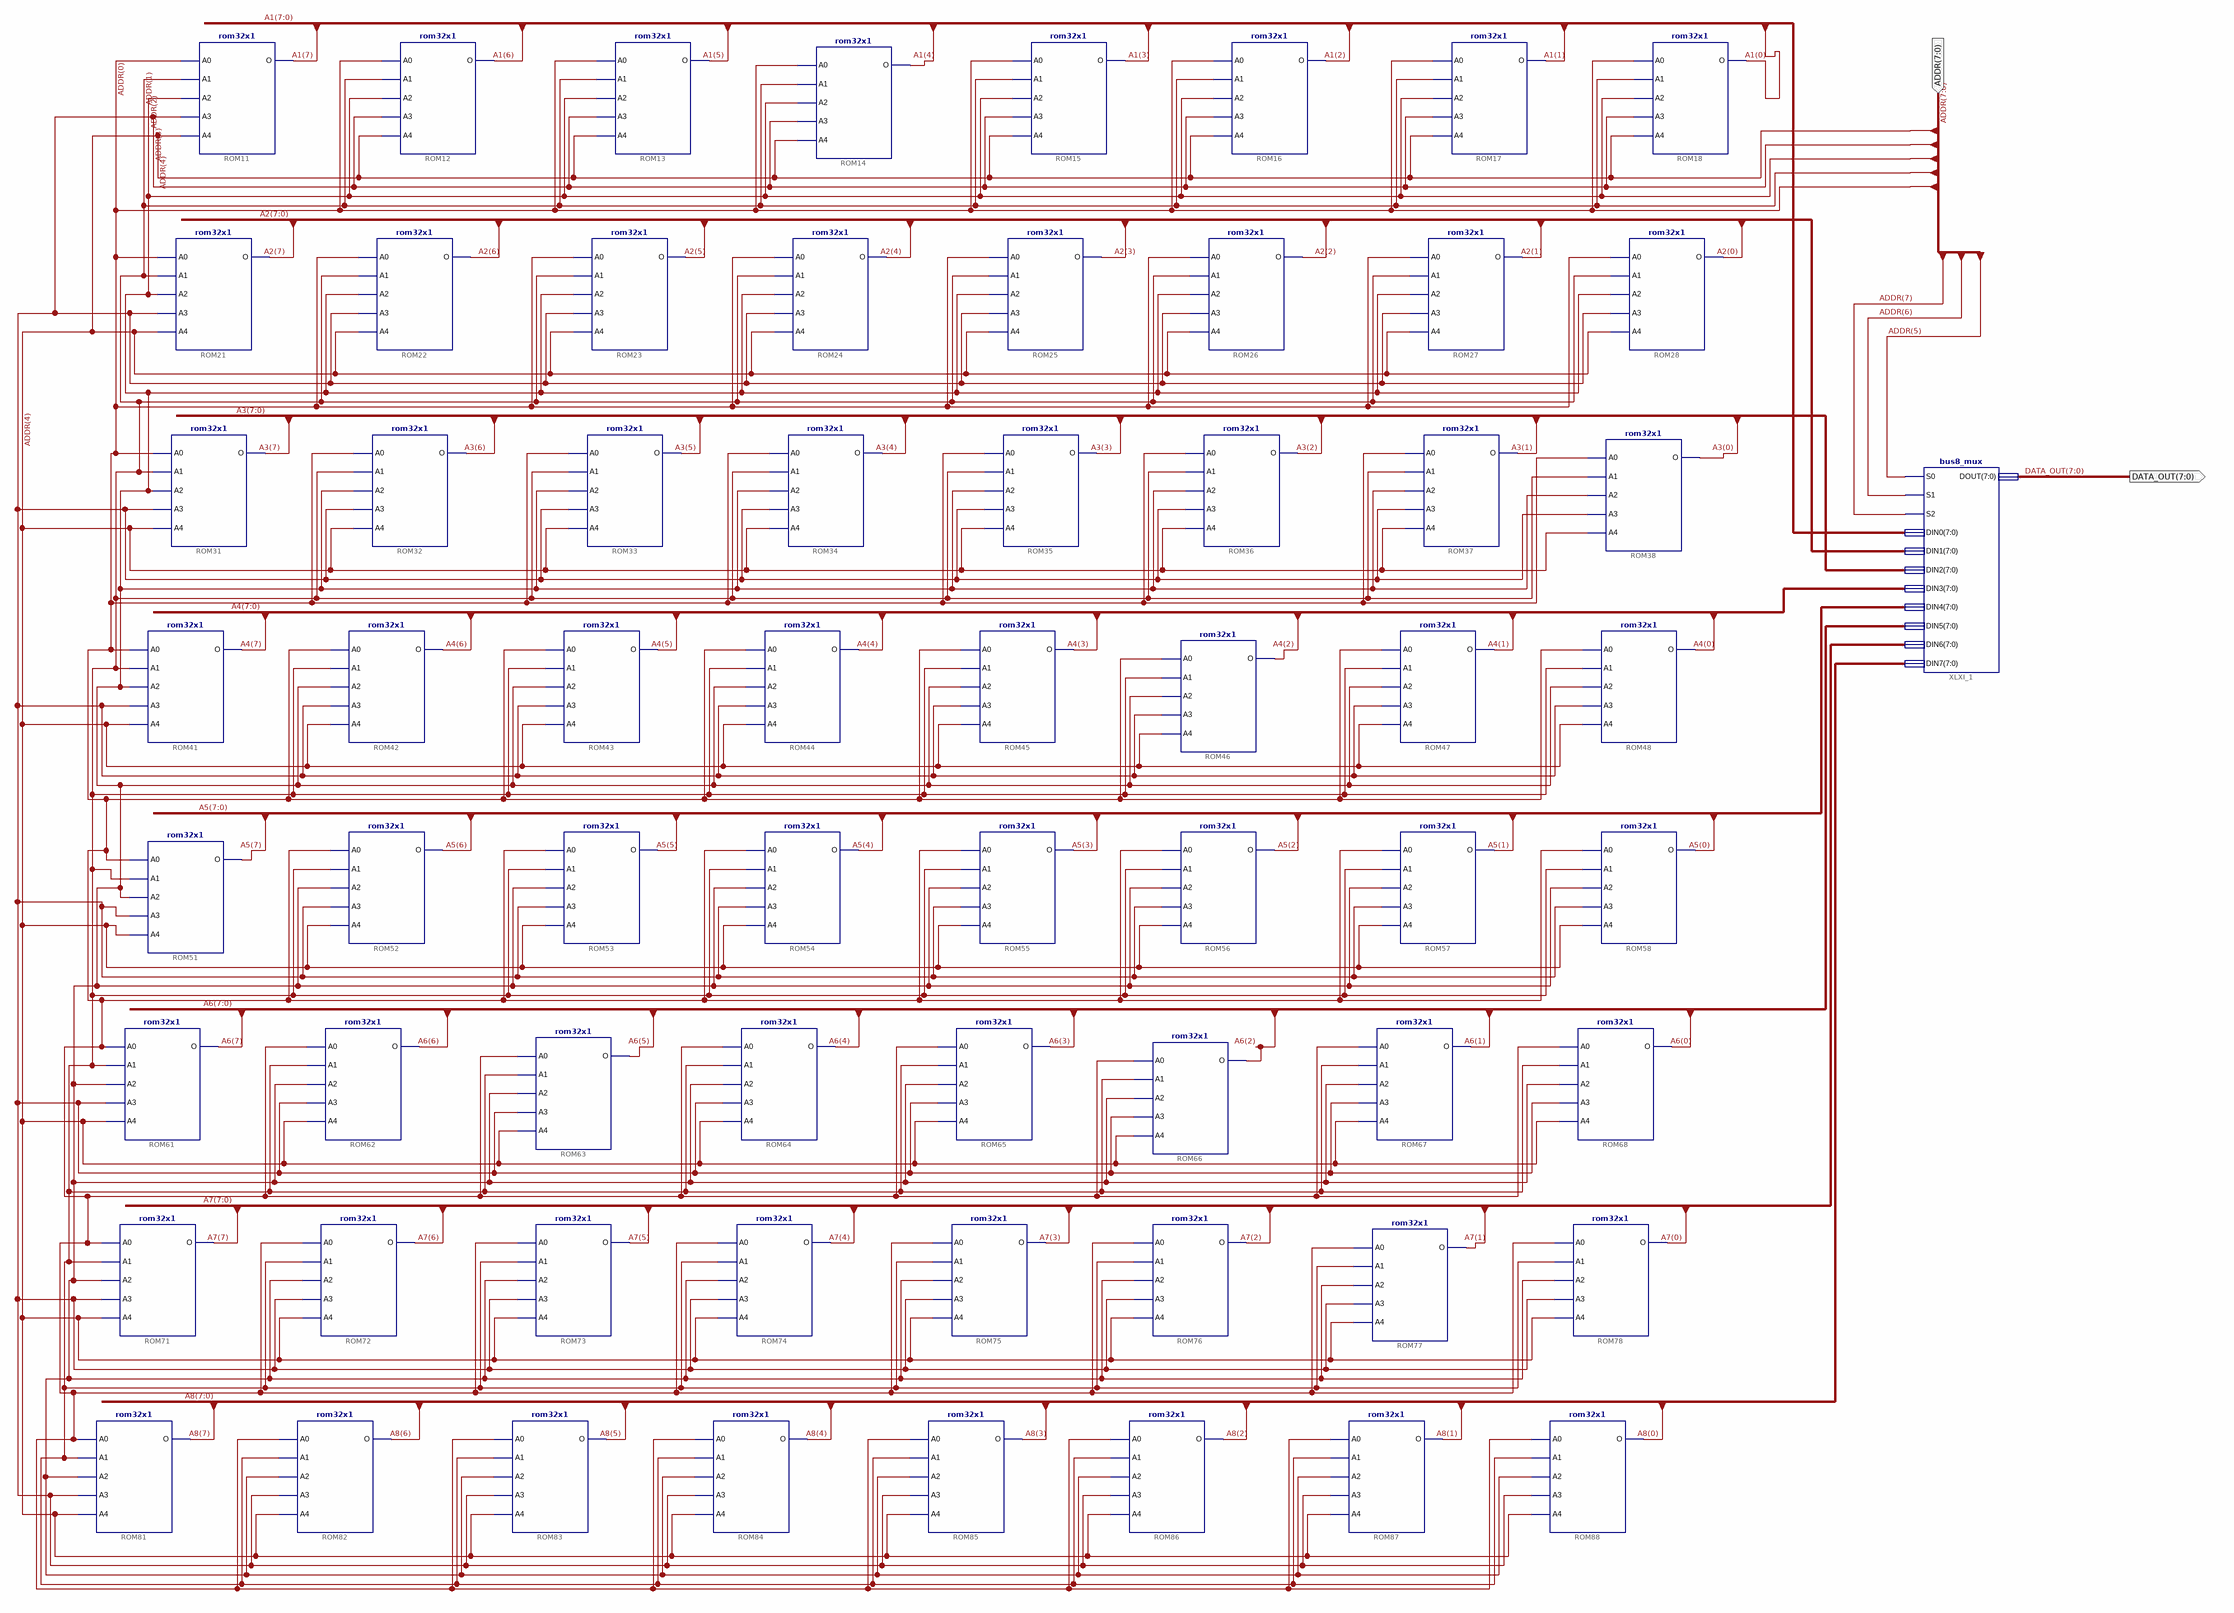
[diagram p0: schematic sheet 1]
// Xilinx ISE schematic ROM_array.sch (spartan3e) as structural Verilog: 65 symbols, 2 ports
module ROM_array (
  input  [7:0] ADDR,
  output [7:0] DATA_OUT
);

  wire [7:0] A1, A2, A3, A4, A5, A6, A7, A8;

  bus8_mux XLXI_1 (
    .DIN0(A1), .DIN1(A2), .DIN2(A3), .DIN3(A4), .DIN4(A5), .DIN5(A6), .DIN6(A7), .DIN7(A8), .DOUT(DATA_OUT),
    .S0(ADDR[5]), .S1(ADDR[6]), .S2(ADDR[7]));
  rom32x1 #(.INIT("0016eeee")) ROM18 (.A0(ADDR[0]), .A1(ADDR[1]), .A2(ADDR[2]), .A3(ADDR[3]), .A4(ADDR[4]), .O(A1[0]));
  rom32x1 #(.INIT("00105050")) ROM17 (.A0(ADDR[0]), .A1(ADDR[1]), .A2(ADDR[2]), .A3(ADDR[3]), .A4(ADDR[4]), .O(A1[1]));
  rom32x1 #(.INIT("00105501")) ROM16 (.A0(ADDR[0]), .A1(ADDR[1]), .A2(ADDR[2]), .A3(ADDR[3]), .A4(ADDR[4]), .O(A1[2]));
  rom32x1 #(.INIT("00150000")) ROM15 (.A0(ADDR[0]), .A1(ADDR[1]), .A2(ADDR[2]), .A3(ADDR[3]), .A4(ADDR[4]), .O(A1[3]));
  rom32x1 #(.INIT("00180000")) ROM14 (.A0(ADDR[0]), .A1(ADDR[1]), .A2(ADDR[2]), .A3(ADDR[3]), .A4(ADDR[4]), .O(A1[4]));
  rom32x1 #(.INIT("0")) ROM13 (.A0(ADDR[0]), .A1(ADDR[1]), .A2(ADDR[2]), .A3(ADDR[3]), .A4(ADDR[4]), .O(A1[5]));
  rom32x1 #(.INIT("0")) ROM12 (.A0(ADDR[0]), .A1(ADDR[1]), .A2(ADDR[2]), .A3(ADDR[3]), .A4(ADDR[4]), .O(A1[6]));
  rom32x1 #(.INIT("0")) ROM11 (.A0(ADDR[0]), .A1(ADDR[1]), .A2(ADDR[2]), .A3(ADDR[3]), .A4(ADDR[4]), .O(A1[7]));
  rom32x1 #(.INIT("0")) ROM28 (.A0(ADDR[0]), .A1(ADDR[1]), .A2(ADDR[2]), .A3(ADDR[3]), .A4(ADDR[4]), .O(A2[0]));
  rom32x1 #(.INIT("0")) ROM27 (.A0(ADDR[0]), .A1(ADDR[1]), .A2(ADDR[2]), .A3(ADDR[3]), .A4(ADDR[4]), .O(A2[1]));
  rom32x1 #(.INIT("0")) ROM26 (.A0(ADDR[0]), .A1(ADDR[1]), .A2(ADDR[2]), .A3(ADDR[3]), .A4(ADDR[4]), .O(A2[2]));
  rom32x1 #(.INIT("0")) ROM25 (.A0(ADDR[0]), .A1(ADDR[1]), .A2(ADDR[2]), .A3(ADDR[3]), .A4(ADDR[4]), .O(A2[3]));
  rom32x1 #(.INIT("0")) ROM24 (.A0(ADDR[0]), .A1(ADDR[1]), .A2(ADDR[2]), .A3(ADDR[3]), .A4(ADDR[4]), .O(A2[4]));
  rom32x1 #(.INIT("0")) ROM23 (.A0(ADDR[0]), .A1(ADDR[1]), .A2(ADDR[2]), .A3(ADDR[3]), .A4(ADDR[4]), .O(A2[5]));
  rom32x1 #(.INIT("0")) ROM22 (.A0(ADDR[0]), .A1(ADDR[1]), .A2(ADDR[2]), .A3(ADDR[3]), .A4(ADDR[4]), .O(A2[6]));
  rom32x1 #(.INIT("0")) ROM21 (.A0(ADDR[0]), .A1(ADDR[1]), .A2(ADDR[2]), .A3(ADDR[3]), .A4(ADDR[4]), .O(A2[7]));
  rom32x1 #(.INIT("0")) ROM38 (.A0(ADDR[0]), .A1(ADDR[1]), .A2(ADDR[2]), .A3(ADDR[3]), .A4(ADDR[4]), .O(A3[0]));
  rom32x1 #(.INIT("0")) ROM37 (.A0(ADDR[0]), .A1(ADDR[1]), .A2(ADDR[2]), .A3(ADDR[3]), .A4(ADDR[4]), .O(A3[1]));
  rom32x1 #(.INIT("0")) ROM36 (.A0(ADDR[0]), .A1(ADDR[1]), .A2(ADDR[2]), .A3(ADDR[3]), .A4(ADDR[4]), .O(A3[2]));
  rom32x1 #(.INIT("0")) ROM35 (.A0(ADDR[0]), .A1(ADDR[1]), .A2(ADDR[2]), .A3(ADDR[3]), .A4(ADDR[4]), .O(A3[3]));
  rom32x1 #(.INIT("0")) ROM34 (.A0(ADDR[0]), .A1(ADDR[1]), .A2(ADDR[2]), .A3(ADDR[3]), .A4(ADDR[4]), .O(A3[4]));
  rom32x1 #(.INIT("0")) ROM33 (.A0(ADDR[0]), .A1(ADDR[1]), .A2(ADDR[2]), .A3(ADDR[3]), .A4(ADDR[4]), .O(A3[5]));
  rom32x1 #(.INIT("0")) ROM32 (.A0(ADDR[0]), .A1(ADDR[1]), .A2(ADDR[2]), .A3(ADDR[3]), .A4(ADDR[4]), .O(A3[6]));
  rom32x1 #(.INIT("0")) ROM31 (.A0(ADDR[0]), .A1(ADDR[1]), .A2(ADDR[2]), .A3(ADDR[3]), .A4(ADDR[4]), .O(A3[7]));
  rom32x1 #(.INIT("0")) ROM48 (.A0(ADDR[0]), .A1(ADDR[1]), .A2(ADDR[2]), .A3(ADDR[3]), .A4(ADDR[4]), .O(A4[0]));
  rom32x1 #(.INIT("0")) ROM47 (.A0(ADDR[0]), .A1(ADDR[1]), .A2(ADDR[2]), .A3(ADDR[3]), .A4(ADDR[4]), .O(A4[1]));
  rom32x1 #(.INIT("0")) ROM46 (.A0(ADDR[0]), .A1(ADDR[1]), .A2(ADDR[2]), .A3(ADDR[3]), .A4(ADDR[4]), .O(A4[2]));
  rom32x1 #(.INIT("0")) ROM45 (.A0(ADDR[0]), .A1(ADDR[1]), .A2(ADDR[2]), .A3(ADDR[3]), .A4(ADDR[4]), .O(A4[3]));
  rom32x1 #(.INIT("0")) ROM44 (.A0(ADDR[0]), .A1(ADDR[1]), .A2(ADDR[2]), .A3(ADDR[3]), .A4(ADDR[4]), .O(A4[4]));
  rom32x1 #(.INIT("0")) ROM43 (.A0(ADDR[0]), .A1(ADDR[1]), .A2(ADDR[2]), .A3(ADDR[3]), .A4(ADDR[4]), .O(A4[5]));
  rom32x1 #(.INIT("0")) ROM42 (.A0(ADDR[0]), .A1(ADDR[1]), .A2(ADDR[2]), .A3(ADDR[3]), .A4(ADDR[4]), .O(A4[6]));
  rom32x1 #(.INIT("0")) ROM41 (.A0(ADDR[0]), .A1(ADDR[1]), .A2(ADDR[2]), .A3(ADDR[3]), .A4(ADDR[4]), .O(A4[7]));
  rom32x1 #(.INIT("0")) ROM58 (.A0(ADDR[0]), .A1(ADDR[1]), .A2(ADDR[2]), .A3(ADDR[3]), .A4(ADDR[4]), .O(A5[0]));
  rom32x1 #(.INIT("0")) ROM57 (.A0(ADDR[0]), .A1(ADDR[1]), .A2(ADDR[2]), .A3(ADDR[3]), .A4(ADDR[4]), .O(A5[1]));
  rom32x1 #(.INIT("0")) ROM56 (.A0(ADDR[0]), .A1(ADDR[1]), .A2(ADDR[2]), .A3(ADDR[3]), .A4(ADDR[4]), .O(A5[2]));
  rom32x1 #(.INIT("0")) ROM55 (.A0(ADDR[0]), .A1(ADDR[1]), .A2(ADDR[2]), .A3(ADDR[3]), .A4(ADDR[4]), .O(A5[3]));
  rom32x1 #(.INIT("0")) ROM54 (.A0(ADDR[0]), .A1(ADDR[1]), .A2(ADDR[2]), .A3(ADDR[3]), .A4(ADDR[4]), .O(A5[4]));
  rom32x1 #(.INIT("0")) ROM53 (.A0(ADDR[0]), .A1(ADDR[1]), .A2(ADDR[2]), .A3(ADDR[3]), .A4(ADDR[4]), .O(A5[5]));
  rom32x1 #(.INIT("0")) ROM52 (.A0(ADDR[0]), .A1(ADDR[1]), .A2(ADDR[2]), .A3(ADDR[3]), .A4(ADDR[4]), .O(A5[6]));
  rom32x1 #(.INIT("0")) ROM51 (.A0(ADDR[0]), .A1(ADDR[1]), .A2(ADDR[2]), .A3(ADDR[3]), .A4(ADDR[4]), .O(A5[7]));
  rom32x1 #(.INIT("0")) ROM68 (.A0(ADDR[0]), .A1(ADDR[1]), .A2(ADDR[2]), .A3(ADDR[3]), .A4(ADDR[4]), .O(A6[0]));
  rom32x1 #(.INIT("0")) ROM67 (.A0(ADDR[0]), .A1(ADDR[1]), .A2(ADDR[2]), .A3(ADDR[3]), .A4(ADDR[4]), .O(A6[1]));
  rom32x1 #(.INIT("0")) ROM66 (.A0(ADDR[0]), .A1(ADDR[1]), .A2(ADDR[2]), .A3(ADDR[3]), .A4(ADDR[4]), .O(A6[2]));
  rom32x1 #(.INIT("0")) ROM65 (.A0(ADDR[0]), .A1(ADDR[1]), .A2(ADDR[2]), .A3(ADDR[3]), .A4(ADDR[4]), .O(A6[3]));
  rom32x1 #(.INIT("0")) ROM64 (.A0(ADDR[0]), .A1(ADDR[1]), .A2(ADDR[2]), .A3(ADDR[3]), .A4(ADDR[4]), .O(A6[4]));
  rom32x1 #(.INIT("0")) ROM63 (.A0(ADDR[0]), .A1(ADDR[1]), .A2(ADDR[2]), .A3(ADDR[3]), .A4(ADDR[4]), .O(A6[5]));
  rom32x1 #(.INIT("0")) ROM62 (.A0(ADDR[0]), .A1(ADDR[1]), .A2(ADDR[2]), .A3(ADDR[3]), .A4(ADDR[4]), .O(A6[6]));
  rom32x1 #(.INIT("0")) ROM61 (.A0(ADDR[0]), .A1(ADDR[1]), .A2(ADDR[2]), .A3(ADDR[3]), .A4(ADDR[4]), .O(A6[7]));
  rom32x1 #(.INIT("0")) ROM78 (.A0(ADDR[0]), .A1(ADDR[1]), .A2(ADDR[2]), .A3(ADDR[3]), .A4(ADDR[4]), .O(A7[0]));
  rom32x1 #(.INIT("0")) ROM77 (.A0(ADDR[0]), .A1(ADDR[1]), .A2(ADDR[2]), .A3(ADDR[3]), .A4(ADDR[4]), .O(A7[1]));
  rom32x1 #(.INIT("0")) ROM76 (.A0(ADDR[0]), .A1(ADDR[1]), .A2(ADDR[2]), .A3(ADDR[3]), .A4(ADDR[4]), .O(A7[2]));
  rom32x1 #(.INIT("0")) ROM75 (.A0(ADDR[0]), .A1(ADDR[1]), .A2(ADDR[2]), .A3(ADDR[3]), .A4(ADDR[4]), .O(A7[3]));
  rom32x1 #(.INIT("0")) ROM74 (.A0(ADDR[0]), .A1(ADDR[1]), .A2(ADDR[2]), .A3(ADDR[3]), .A4(ADDR[4]), .O(A7[4]));
  rom32x1 #(.INIT("0")) ROM73 (.A0(ADDR[0]), .A1(ADDR[1]), .A2(ADDR[2]), .A3(ADDR[3]), .A4(ADDR[4]), .O(A7[5]));
  rom32x1 #(.INIT("0")) ROM72 (.A0(ADDR[0]), .A1(ADDR[1]), .A2(ADDR[2]), .A3(ADDR[3]), .A4(ADDR[4]), .O(A7[6]));
  rom32x1 #(.INIT("0")) ROM71 (.A0(ADDR[0]), .A1(ADDR[1]), .A2(ADDR[2]), .A3(ADDR[3]), .A4(ADDR[4]), .O(A7[7]));
  rom32x1 #(.INIT("0")) ROM88 (.A0(ADDR[0]), .A1(ADDR[1]), .A2(ADDR[2]), .A3(ADDR[3]), .A4(ADDR[4]), .O(A8[0]));
  rom32x1 #(.INIT("0")) ROM87 (.A0(ADDR[0]), .A1(ADDR[1]), .A2(ADDR[2]), .A3(ADDR[3]), .A4(ADDR[4]), .O(A8[1]));
  rom32x1 #(.INIT("0")) ROM86 (.A0(ADDR[0]), .A1(ADDR[1]), .A2(ADDR[2]), .A3(ADDR[3]), .A4(ADDR[4]), .O(A8[2]));
  rom32x1 #(.INIT("0")) ROM85 (.A0(ADDR[0]), .A1(ADDR[1]), .A2(ADDR[2]), .A3(ADDR[3]), .A4(ADDR[4]), .O(A8[3]));
  rom32x1 #(.INIT("0")) ROM84 (.A0(ADDR[0]), .A1(ADDR[1]), .A2(ADDR[2]), .A3(ADDR[3]), .A4(ADDR[4]), .O(A8[4]));
  rom32x1 #(.INIT("0")) ROM83 (.A0(ADDR[0]), .A1(ADDR[1]), .A2(ADDR[2]), .A3(ADDR[3]), .A4(ADDR[4]), .O(A8[5]));
  rom32x1 #(.INIT("0")) ROM82 (.A0(ADDR[0]), .A1(ADDR[1]), .A2(ADDR[2]), .A3(ADDR[3]), .A4(ADDR[4]), .O(A8[6]));
  rom32x1 #(.INIT("0")) ROM81 (.A0(ADDR[0]), .A1(ADDR[1]), .A2(ADDR[2]), .A3(ADDR[3]), .A4(ADDR[4]), .O(A8[7]));
endmodule
